# EAGLE design Micro4You (EAGLE 7.5.0)
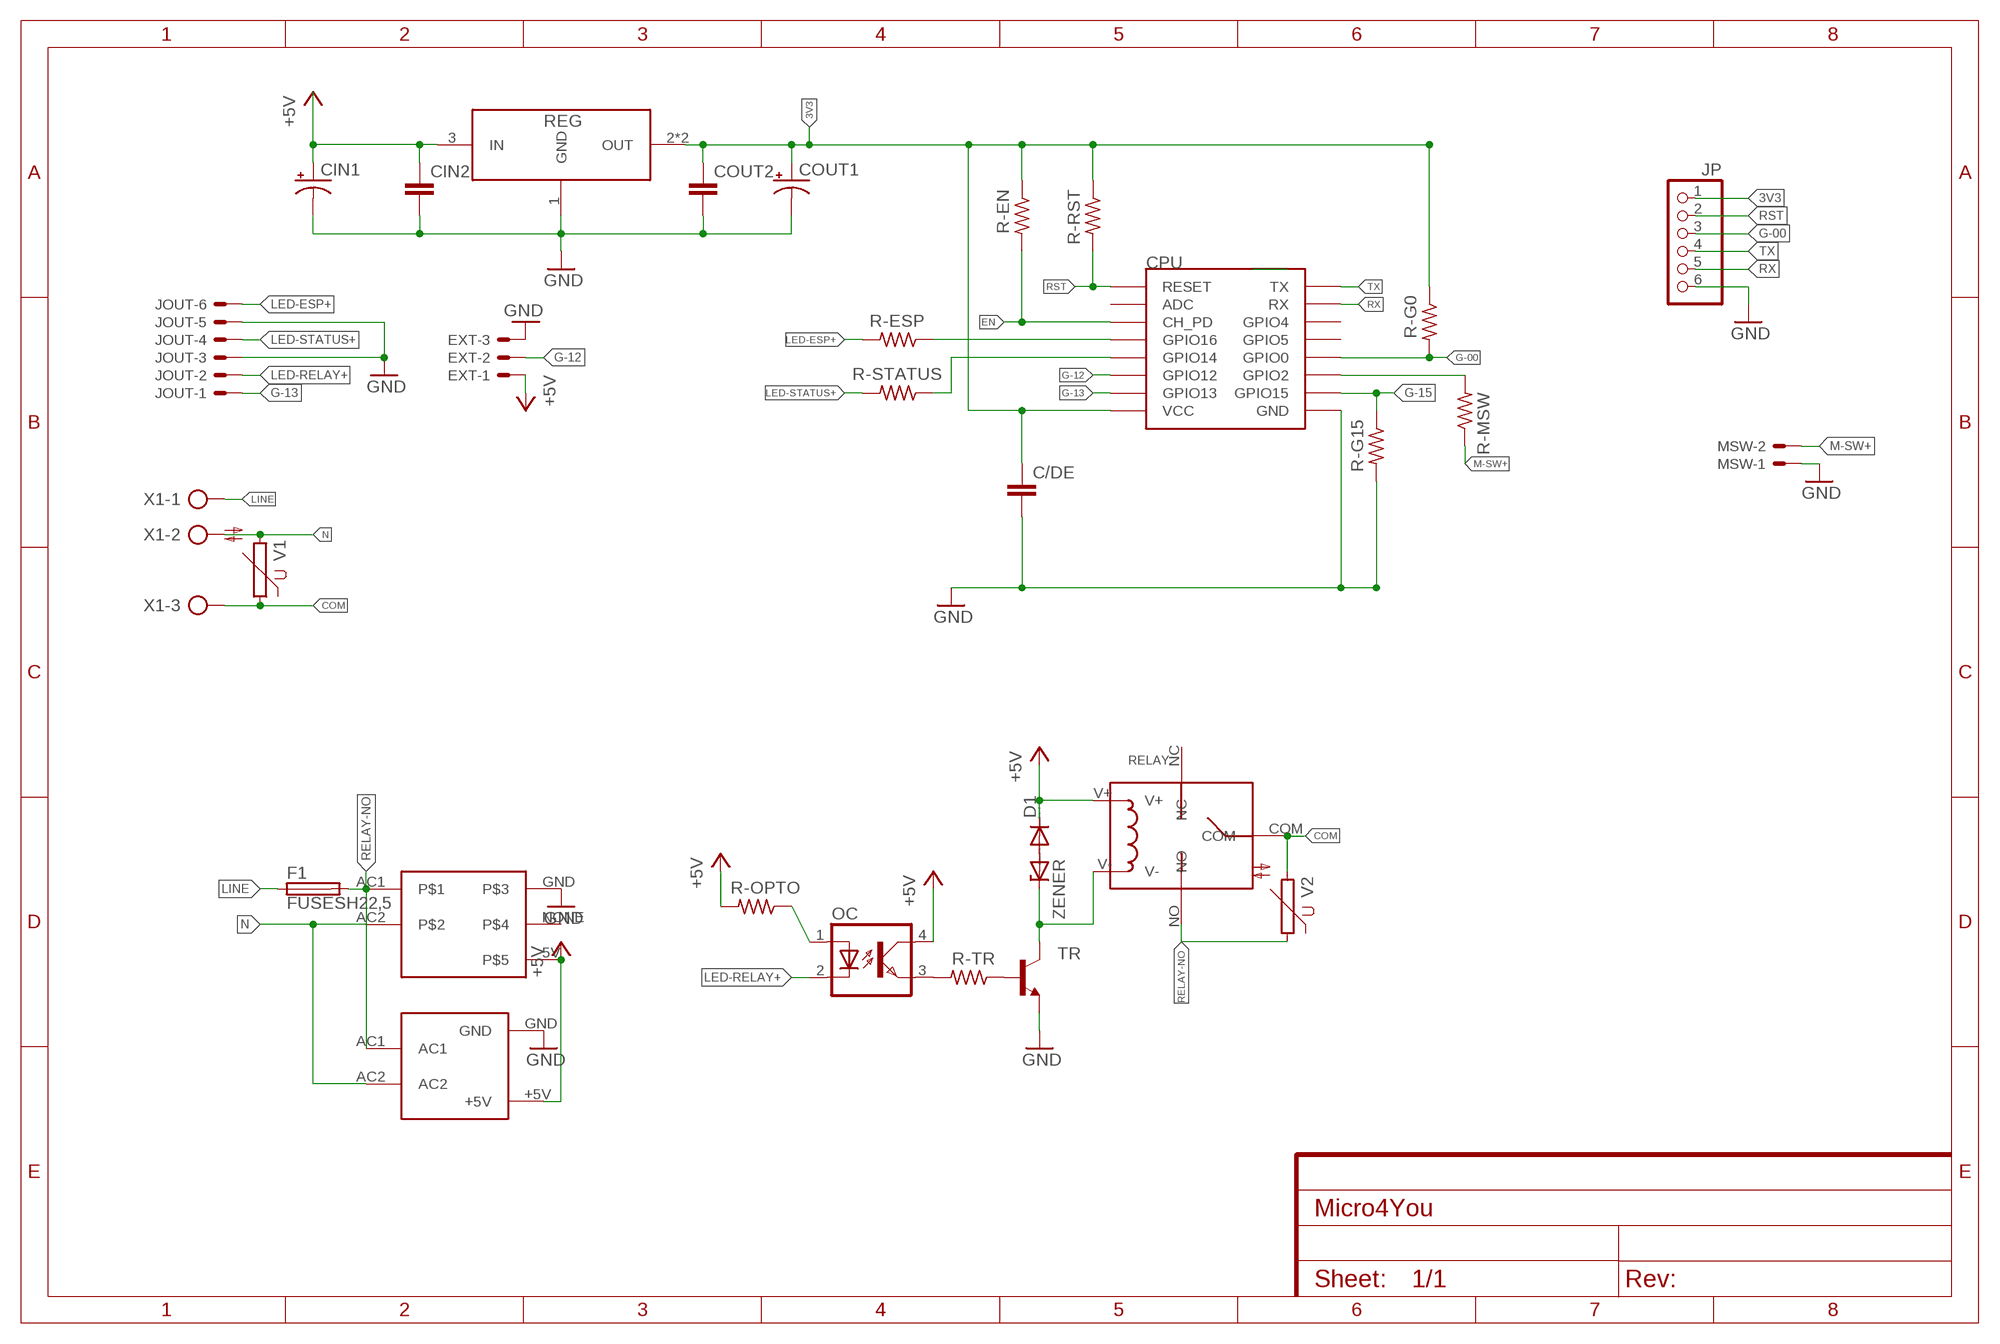
[diagram p0: schematic, sheet 1]

## Parts
C/DE  C-EUC0805  [C0805]
CIN1  CPOL-USE2.5-5  [E2,5-5]
CIN2  C-EUC0805  [C0805]
COUT1  CPOL-USE2.5-5  [E2,5-5]
COUT2  C-EUC0805  [C0805]
CPU  ESP12SMD  [ESP12-SMD]
D1  1N4148DO35-7  [DO35-7]
EXT  53048-03  [53048-03]
F1  FUSESH22,5  [SH22,5]
HLK  HLK-PM01  [HLK-PM01]
JOUT  53048-06  [53048-06]
JP  PINHD-1X6  [1X06]
MSW  53048-02  [53048-02]
OC  PC817  [DIL04]
R-EN  R-US_M0805  [M0805]
R-ESP  R-US_M0805  [M0805]
R-G0  R-US_M0805  [M0805]
R-G15  R-US_M0805  [M0805]
R-MSW  R-US_M0805  [M0805]
R-OPTO  R-US_M0805  [M0805]
R-RST  R-US_M0805  [M0805]
R-STATUS  R-US_M0805  [M0805]
R-TR  R-US_M0805  [M0805]
REG  AMS1117-3.3  [SOT-223]
RELAY  RELAY-SONGLE  [RELAY-SONGLE]
TR  BC817-16SMD  [SOT23-BEC]
U$4  POWERSUPPLY-5V-700MA  [POWERSUPPLY-5V-700MA]
V1  S14K11  [S14K11]
V2  S14K11  [S14K11]
X1  AK300/3  [AK300/3]
ZENER  1N4728  [DO41Z10]

## Nets
3V3: C/DE.1 COUT1.+ COUT2.1 CPU.VCC JP.1 R-EN.1 R-G0.1 R-RST.1 REG.2(OUT) REG.4(OUT)
+5V: CIN1.+ CIN2.1 D1.C EXT.1 HLK.+5V OC.4(COL) R-OPTO.2 REG.3(IN) RELAY.V+ U$4.5V
COM: RELAY.COM V1.1 V2.2 X1.3
EN: CPU.CH_PD R-EN.2
G-00: CPU.GPIO0 JP.3 R-G0.2
G-12: CPU.GPIO12 EXT.2
G-13: CPU.GPIO13 JOUT.1
G-15: CPU.GPIO15 R-G15.1
GND: C/DE.2 CIN1.- CIN2.2 COUT1.- COUT2.2 CPU.GND EXT.3 HLK.GND JOUT.3 JOUT.5 JP.6 MSW.1 R-G15.2 REG.1(GND) TR.E U$4.GND
LED-ESP+: JOUT.6 R-ESP.2
LED-RELAY+: JOUT.2 OC.2(C)
LED-STATUS+: JOUT.4 R-STATUS.2
LINE: F1.1 X1.1
M-SW+: MSW.2 R-MSW.1
N: HLK.AC2 U$4.AC2 V1.2 X1.2
N$1: OC.3(EMIT) R-TR.2
N$2: R-TR.1 TR.B
N$7: CPU.GPIO2 R-MSW.2
N$8: CPU.GPIO14 R-STATUS.1
N$13: OC.1(A) R-OPTO.1
N$16: D1.A ZENER.A
N$17: RELAY.V- TR.C ZENER.C
N$19: CPU.GPIO16 R-ESP.1
RELAY-NO: F1.2 HLK.AC1 RELAY.NO U$4.AC1 V2.1
RST: CPU.RESET JP.2 R-RST.2
RX: CPU.RXD0(RX) JP.5
TX: CPU.TXD0(TX) JP.4
Unconnected: CPU.ADC CPU.GPIO4 CPU.GPIO5 RELAY.NC U$4.NONE

## Library data of the parts
C/DE CIN2 COUT2 = rcl:C-EU: CAPACITOR, European symbol
CIN1 COUT1 = rcl:CPOL-US: POLARIZED CAPACITOR, American symbol
CPU = esp8266modules:ESP12: ESP8266 Wifi module 12
D1 = diode:1N4148: DIODE high speed (Philips)
EXT = con-molex:53?-03: CONNECTOR wire to board 1.25 mm (.049 inch) pitch header; MF: WALDOM/MOLEX; MPN: 53048-0310; OC_FARNELL: 9732918; OC_NEWARK: 38C9908
F1 = fuse:FUSE: Fuse; OC_FARNELL: unknown; OC_NEWARK: unknown
HLK = HLK-PM01:HLK-PM01
JOUT = con-molex:53?-06: CONNECTOR wire to board 1.25 mm (.049 inch) pitch header; MF: WALDOM/MOLEX; MPN: 53048-0610; OC_FARNELL: 1012260; OC_NEWARK: 38C9911
JP = pinhead:PINHD-1X6: PIN HEADER
MSW = con-molex:53?-02: CONNECTOR wire to board 1.25 mm (.049 inch) pitch header; MF: MOLEX; MPN: 53048-0210; OC_FARNELL: 1012259; OC_NEWARK: 57H4718
OC = optocoupler:PC817: SHARP OPTO COUPLER; MPN: PC817X4J000F; OC_FARNELL: 9707727; OC_NEWARK: 97K7059
R-EN R-ESP R-G0 R-G15 R-MSW R-OPTO R-RST R-STATUS R-TR = rcl:R-US_: RESISTOR, American symbol
REG = AMS1117-3.3:AMS1117-3.3: 1A LOW DROPOUT VOLTAGE REGULATOR
RELAY = Seeed-OPL-Relay:RELAY-SONGLE
TR = transistor-npn:BC817*: NPN Transistor
U$4 = PowerSupply-5V-700mA:POWERSUPPLY-5V-700MA
V1 V2 = varistor:S14K11: VARISTOR
X1 = con-ptr500:AK300/3: CONNECTOR; OC_FARNELL: unknown; OC_NEWARK: unknown
ZENER = diode:1N4728: Z DIODE 3.3 V, 1W, 5 percent

## Board
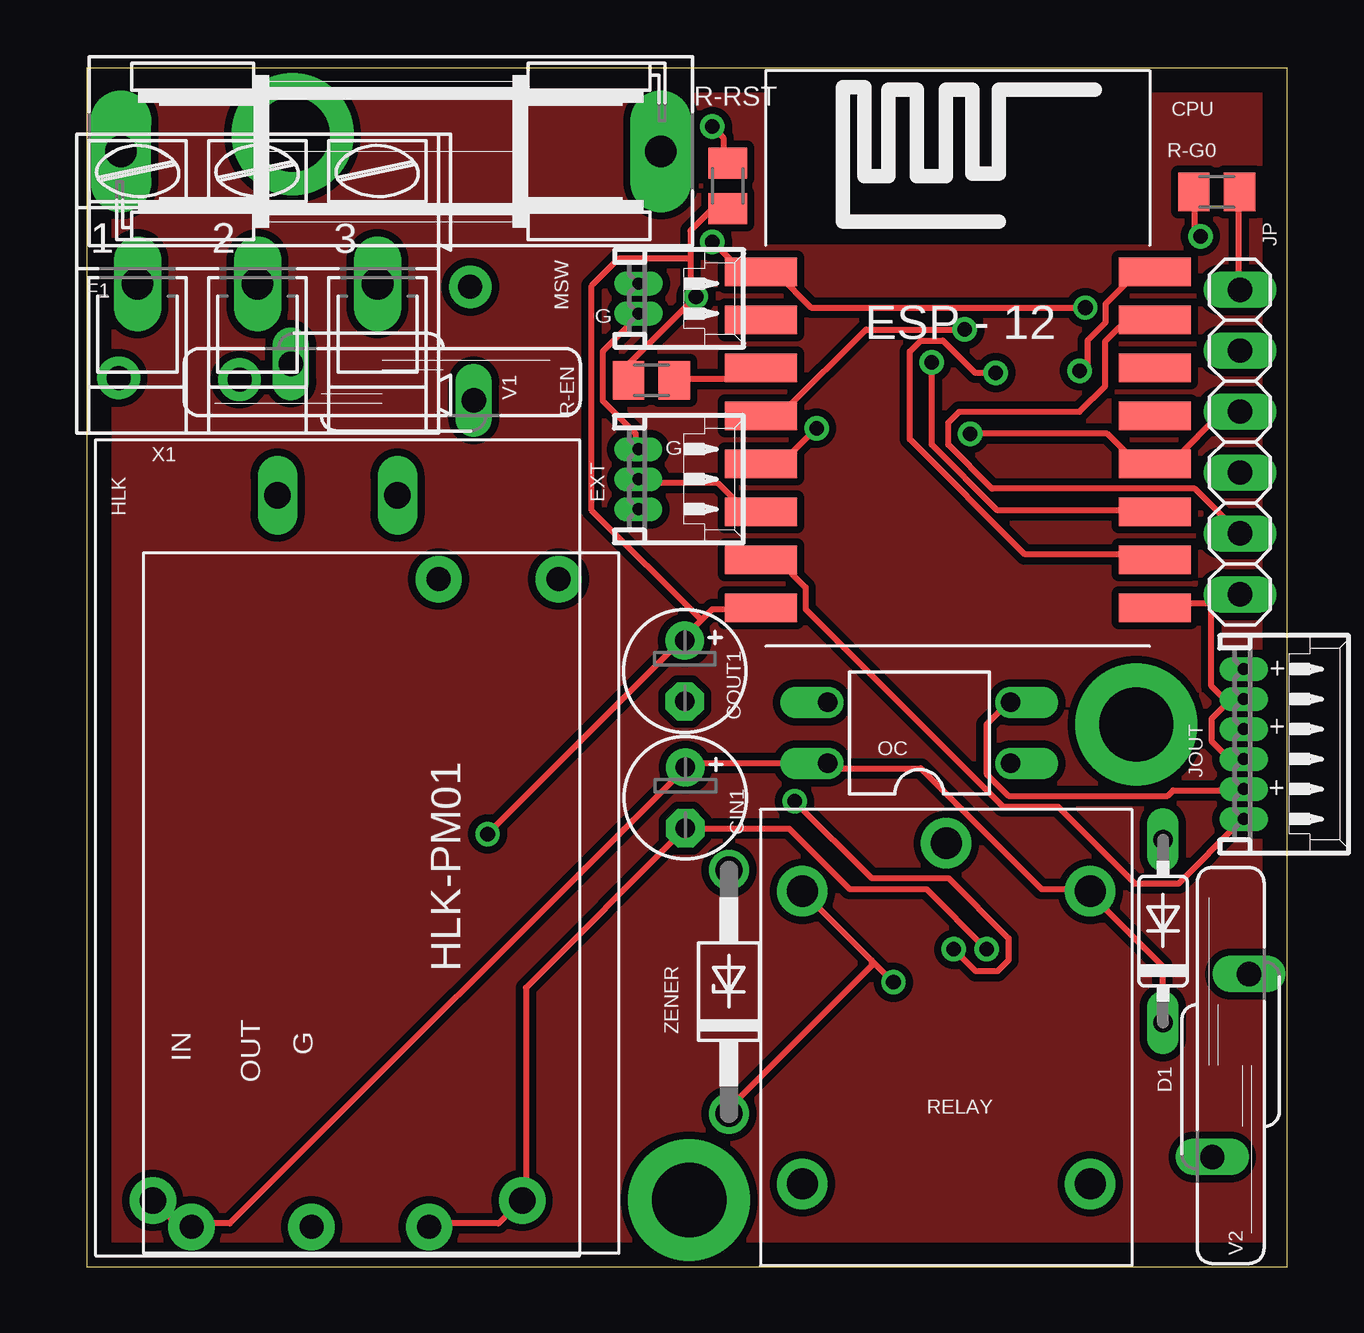
[diagram p1: board, top side]
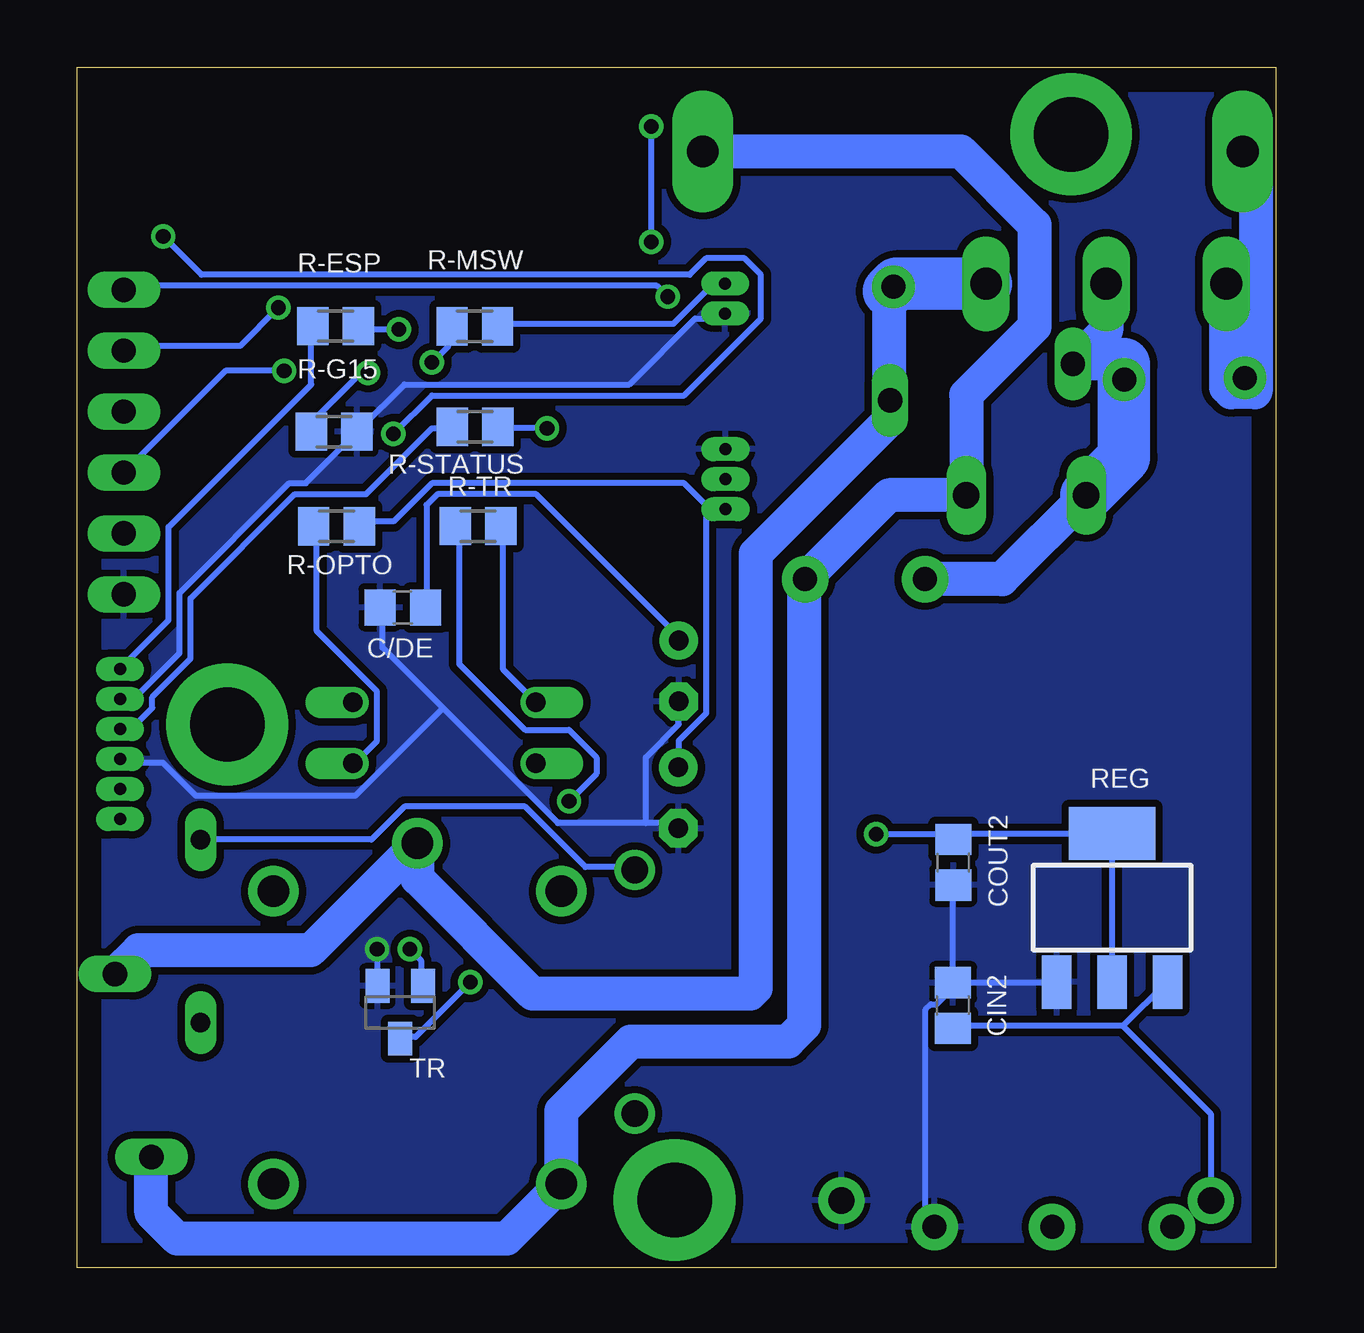
[diagram p2: board, bottom side, seen from below]

Size 50 x 50 mm. Coordinates in mm from the lower left corner, seen from the top.
Outline: 0,0 0,50 28.2,50 44.31,50 50,50 50,0 0,0
Copper layers (1*16): Top 0.035mm / dielectric 1.5mm / Bottom 0.035mm
Design rules "default": minimum track width 10mil, minimum drill 24mil, track to track 8mil, track to pad 8mil, pad to pad 8mil, via to via 8mil, smd to smd 8mil, copper to edge 40mil, drill to drill 8mil, minimum pad ring 10mil, minimum via ring 8mil, stop-mask expansion 4mil, vias tented up to drill 0mil, thermal gap 10mil

### Footprints (pad centres in the part's own frame; a part is rotated, then mirrored left to right if it is on the bottom)
C0805 = smd 1.3 x 1.5: 1 -0.95,0; 2 0.95,0
E2,5-5 = drill 0.813 pad 1.6: + -1.27,0 | drill 0.813 pad 1.6 octagon: - 1.27,0
ESP12-SMD = smd 3 x 1.2: ADC -8.3,3.8; CH_PD -8.3,1.8; GND 8.1,-8.2; GPIO0 8.1,-2.2; GPIO2 8.1,-4.2; GPIO4 8.1,1.8; GPIO5 8.1,-0.2; GPIO12 -8.3,-4.2; GPIO13 -8.3,-6.2; GPIO14 -8.3,-2.2; GPIO15 8.1,-6.2; GPIO16 -8.3,-0.2; RESET -8.3,5.8; RXD0 8.1,3.8; TXD0 8.1,5.8; VCC -8.3,-8.2
DO35-7 = drill 0.813 long: A 3.81,0; C -3.81,0
53048-03 = drill 0.5 pad 0.698 long: 1 1.25,-1.25; 2 0,-1.25; 3 -1.25,-1.25
SH22,5 = drill 1.321 pad 2.54 long: 1 -11.252,0; 2 11.252,0
HLK-PM01 = drill 1.1 pad 1.93: +5V 15.19,-7.76; GND 15.19,7.64 | drill 1.1 long: AC1 -14.21,2.44; AC2 -14.21,-2.56
53048-06 = drill 0.5 pad 0.698 long: 1 3.125,-1.25; 2 1.875,-1.25; 3 0.625,-1.25; 4 -0.625,-1.25; 5 -1.875,-1.25; 6 -3.125,-1.25
1X06 = drill 1.016 long: 1 -6.35,0; 2 -3.81,0; 3 -1.27,0; 4 1.27,0; 5 3.81,0; 6 6.35,0
53048-02 = drill 0.5 pad 0.698 long: 1 0.625,-1.25; 2 -0.625,-1.25
DIL04 = drill 0.813 offset: 1 -1.27,-3.81; 2 1.27,-3.81; 3 1.27,3.81; 4 -1.27,3.81
M0805 = smd 1.3 x 1.6: 1 -0.95,0; 2 0.95,0
SOT-223 = smd 1.219 x 2.235: 1 -2.381,-3.099; 2 -0.07,-3.099; 3 2.241,-3.099 | smd 3.6 x 2.2: 4 -0.07,3.099
RELAY-SONGLE = drill 1.3 pad 2.1: COM -8.1,0; NC 6.1,6; NO 6.1,-6; V+ -6.1,6; V- -6.1,-6
SOT23-BEC = smd 1 x 1.4: B -0.95,-1.1; C 0,1.1; E 0.95,-1.1
POWERSUPPLY-5V-700MA = drill 1 pad 1.93: 5V 13.5,-7.9; AC1 -13.5,7.4; AC2 -13.5,2.4; GND 13.5,2; NONE 13.5,-2.9
S14K11 = drill 1.016 long: 1 -0.762,-3.81; 2 0.762,3.81
AK300/3 = drill 1.321 long: 1 -5.004,0; 2 0,0; 3 5.004,0
DO41Z10 = drill 1.118: A 5.08,0; C -5.08,0

### Placement (x,y rotation side)
C/DE  36.42,27.51 180 bottom
CIN1  24.93,19.57 270 top
CIN2  13.49,10.92 90 bottom
COUT1  24.91,24.86 270 top
COUT2  13.48,16.88 270 bottom
CPU  36.39,35.69 0 top
D1  44.84,14.02 90 top
EXT  24.22,32.85 270 top
F1  12.66,46.52 0 top
HLK  10.49,17.98 270 top
JOUT  49.46,21.81 270 top
JP  48.05,34.4 270 top
MSW  24.23,40.39 270 top
OC  34.68,22.28 90 top
R-EN  23.52,36.97 0 top
R-ESP  39.22,39.23 180 bottom
R-G0  47.08,44.82 180 top
R-G15  39.28,34.84 0 bottom
R-MSW  33.42,39.22 180 bottom
R-OPTO  39.18,30.89 0 bottom
R-RST  26.7,45.08 90 top
R-STATUS  33.4,35.04 180 bottom
R-TR  33.28,30.9 0 bottom
REG  6.78,14.99 0 bottom
RELAY  35.81,9.58 270 top
TR  36.53,10.63 180 bottom
U$4  12.25,15.19 270 top
V1  12.3,36.9 90 top
V2  47.66,8.41 0 top
X1  7.1,41 0 top
ZENER  26.75,11.49 90 top

### Tracks (layer width: path | path; a pad name or v marks a point on that pad's centre or on a via)
3V3  (via drill 0.61)
  Top 0.254: R-G0.1 48.01,44.81 48.01,40.92 JP.1 | 25.15,42.06 25.15,43.2 26.06,44.12 26.52,44.12 R-RST.1 | 25.15,42.06 25.15,40.46 | 25.15,40.46 25.15,40.23 22.63,37.72 22.63,37.03 R-EN.1 | 25.15,40.46 v25.38,40.46 | 25.6,26.98 24.92,26.29 COUT1.+ 24.69,26.06 v16.69,18.06 | 25.6,26.98 26.06,27.43 27.89,27.43 CPU.VCC | 25.15,42.06 22.17,42.06 21.03,40.92 21.03,31.55 25.6,26.98
  Bottom 0.254: v25.38,40.46 25.83,40.92 48.01,40.92 JP.1 | 6.86,18.06 13.26,18.06 COUT2.1 13.49,18.06 v16.69,18.06 | 6.86,18.06 6.86,12.12 REG.2 | 6.86,18.06 REG.4 | C/DE.1 35.43,27.66 35.43,31.77 34.98,32.23 30.86,32.23 24.92,26.29 COUT1.+
+5V
  Top 0.254: HLK.+5V 2.74,2.74 3.66,1.83 4.34,1.83 U$4.5V 4.57,1.83 5.94,1.83 24.92,20.8 CIN1.+ 25.15,21.03 30.86,21.03 OC.4 31.09,20.8 34.75,20.8 39.78,15.77 41.6,15.77 RELAY.V+ 41.83,15.54 44.81,12.57 44.81,10.29 D1.C
  Bottom 0.254: 6.4,10.06 13.26,10.06 CIN2.1 | 6.4,10.06 4.57,11.89 REG.3 | 6.4,10.06 2.74,6.4 2.74,2.97 HLK.+5V | 23.77,31.77 24.69,32.69 35.2,32.69 36.8,31.09 38.18,31.09 R-OPTO.2 | 23.77,31.77 23.09,31.77 EXT.1 23.77,31.77 | 23.77,31.77 23.77,23.09 24.92,21.95 24.92,21.03 CIN1.+
COM
  Bottom 1.422: V2.2 47.43,13.22 40.27,13.22 RELAY.COM 35.81,16.21 31,11.4 21.94,11.4 21.71,11.63 21.71,29.74 16.11,35.34 V1.1 16.15,36.18 16.15,40.69
  Bottom 2.184: X1.3 15.84,41 16.15,40.69
EN
  Top 0.254: R-EN.2 24.69,37.03 27.43,37.03 27.89,37.49 CPU.CH_PD
G-00  (via drill 0.61)
  Top 0.254: v46.41,42.98 46.18,43.2 46.18,44.81 R-G0.2 | v36.8,34.75 42.52,34.75 43.66,33.6 44.35,33.6 CPU.GPIO0 44.58,33.6 45.26,33.6 47.32,35.66 48.01,35.66 JP.3
  Bottom 0.254: v46.41,42.98 44.81,41.38 24.46,41.38 23.77,42.06 22.17,42.06 21.49,41.38 21.49,39.55 24.69,36.35 35.2,36.35 v36.8,34.75
G-12
  Top 0.254: EXT.2 23.09,32.69 26.29,32.69 27.43,31.55 27.89,31.55 CPU.GPIO12
G-13
  Top 0.254: JOUT.1 48.01,18.52 45.49,16 43.66,16 40.46,19.2 38.18,19.2 29.95,27.43 29.95,28.35 28.8,29.49 28.12,29.49 CPU.GPIO13
G-15  (via drill 0.61)
  Top 0.254: CPU.GPIO15 44.35,29.72 39.09,29.72 34.29,34.52 34.29,38.18 34.75,38.63 35.66,38.63 37.01,37.29 v37.87,37.29
  Bottom 0.254: R-G15.1 40.01,34.98 40.01,35.43 38.15,37.29 v37.87,37.29
GND  (via drill 0.61)
  Top 0.254: 46.86,27.66 47.78,27.66 48.01,27.89 JP.6 46.86,27.66 | 46.86,27.66 44.58,27.66 CPU.GND | EXT.3 22.86,34.29 22.86,34.75 21.49,36.12 21.49,38.18 22.86,39.55 MSW.1 | 47.55,23.55 46.86,22.86 46.86,21.95 47.55,21.26 48.01,21.26 JOUT.3 | 47.55,23.55 48.01,23.55 JOUT.5 47.55,23.55 | 46.86,27.66 46.86,24.23 47.55,23.55 | U$4.GND 14.4,1.83 17.14,1.83 18.06,2.74 HLK.GND 18.29,2.97 18.29,11.66 24.92,18.29 CIN1.- 25.15,18.29 29.26,18.29 31.77,15.77 34.98,15.77 v37.49,13.26
  Bottom 0.254: JOUT.5 48.01,23.77 47.55,23.77 45.72,25.6 45.72,28.12 41.15,32.69 40.46,32.69 38.41,34.75 R-G15.2 38.18,34.98 36.35,36.8 26.98,36.8 24.23,39.55 23.09,39.55 MSW.1 | COUT2.2 13.49,15.77 13.49,11.89 CIN2.2 | REG.1 9.37,11.89 13.26,11.89 CIN2.2 | CIN2.2 13.49,11.66 14.17,10.97 14.4,10.97 14.63,10.74 14.63,2.06 14.4,1.83 U$4.GND | v37.49,13.26 37.49,11.89 TR.E | 34.75,23.32 29.95,18.52 26.29,18.52 | 34.75,23.32 37.26,25.83 37.26,27.43 C/DE.2 | 26.29,18.52 25.15,18.52 CIN1.- | 26.29,18.52 26.29,21.26 24.92,22.63 24.92,23.55 COUT1.- | 34.75,23.32 38.41,19.66 45.03,19.66 46.41,21.03 48.01,21.03 JOUT.3
  pour Bottom (isolate 0.305): 0,0 50,0 50,50 0,50
LED-ESP+
  Bottom 0.254: R-ESP.2 40.23,39.09 40.23,36.8 46.18,30.86 46.18,26.98 48.01,25.15 JOUT.6
LED-RELAY+
  Top 0.254: JOUT.2 48.01,19.89 45.26,19.89 45.03,19.66 38.41,19.66 37.49,20.57 37.49,22.63 38.41,23.55 OC.2
LED-STATUS+
  Bottom 0.254: R-STATUS.2 34.52,34.98 35.2,34.98 37.95,32.23 40.92,32.23 45.26,27.89 45.26,25.38 46.86,23.77 46.86,23.32 47.55,22.63 48.01,22.63 JOUT.4
LINE
  Bottom 1.422: F1.1 0.87,45.98 0.87,36.51 0.9,36.48 1.89,36.48 2.1,36.69 X1.1
M-SW+
  Bottom 0.254: R-MSW.1 32.46,39.32 25.15,39.32 23.55,40.92 23.09,40.92 MSW.2
N
  Bottom 1.422: HLK.AC2 11.44,28.69 U$4.AC2 | 6.36,37.64 6.38,37.66 V1.2 7.1,39.05 X1.2
  Bottom 2.184: HLK.AC2 6.36,33.76 6.36,37.64
N$1
  Bottom 0.254: R-TR.2 32.23,30.86 32.23,24.92 31.09,23.77 OC.3
N$2  (via drill 0.61)
  Top 0.254: v36.12,13.26 37.03,12.34 37.95,12.34 38.41,12.8 38.41,13.72 35.89,16.23 32.69,16.23 v29.49,19.43
  Bottom 0.254: v36.12,13.26 35.66,12.8 35.66,11.89 TR.B | v29.49,19.43 28.35,20.57 28.35,21.26 29.49,22.4 31.32,22.4 34.06,25.15 34.06,30.86 R-TR.1
N$3  (via drill 3.1 pad 5.08)
  other vias: 25.09,2.81
N$4
  pour Top (isolate 0.305): 0,0 50,0 50,50 44.4,50 44.4,42.5 28.19,42.5 28.19,50 0,50
N$7  (via drill 0.61)
  Top 0.254: v35.2,37.72 35.2,34.29 37.95,31.55 44.35,31.55 CPU.GPIO2
  Bottom 0.254: v35.2,37.72 34.52,38.41 34.52,39.09 R-MSW.2
N$8  (via drill 0.61)
  Top 0.254: v30.4,34.98 29.03,33.6 28.12,33.6 CPU.GPIO14
  Bottom 0.254: v30.4,34.98 32.23,34.98 R-STATUS.1
N$9  (via drill 3.1 pad 5.08)
  other vias: 43.73,22.63
N$13
  Bottom 0.254: R-OPTO.1 40.01,30.86 40.01,26.52 37.49,24 37.49,21.95 38.41,21.03 OC.1
N$16
  Bottom 0.254: D1.A 44.81,17.83 37.72,17.83 36.35,19.2 31.32,19.2 28.8,16.69 26.75,16.69 ZENER.A
N$17  (via drill 0.61)
  Top 0.254: 32.69,12.8 29.95,15.54 RELAY.V- | 32.69,12.8 v33.6,11.89 | 32.69,12.8 32.69,12.57 26.75,6.63 ZENER.C
  Bottom 0.254: v33.6,11.89 35.89,9.6 36.35,9.6 TR.C
N$18  (via drill 3.1 pad 5.08)
  other vias: 8.56,47.23
N$19  (via drill 0.61)
  Top 0.254: v36.58,39.09 32.46,39.09 29.03,35.66 28.12,35.66 CPU.GPIO16
  Bottom 0.254: v36.58,39.09 38.18,39.09 R-ESP.1
N$20  (via drill 1 pad 1.78)
  other vias: 1.32,37.07
N$21  (via drill 1 pad 1.78)
  other vias: 6.35,37
N$22  (via drill 1 pad 1.78)
  other vias: 15.97,40.87
RELAY-NO
  Bottom 1.422: V2.1 46.9,2.28 45.82,1.2 32.09,1.2 RELAY.NO 29.81,6.52 26.91,9.42 20.36,9.42 19.68,10.1 19.68,28.66 U$4.AC1 16.15,32.19 HLK.AC1 12.94,36.38 10.09,39.22 10.09,43.45 13.16,46.52 F1.2
RST  (via drill 0.61)
  Top 0.254: v26.06,47.55 26.52,47.09 26.52,46.18 R-RST.2 | v26.06,42.75 27.43,41.38 27.89,41.38 CPU.RESET 28.12,41.38 28.8,41.38 30.18,40.01 v41.6,40.01
  Bottom 0.254: v26.06,42.75 v26.06,47.55 | v41.6,40.01 43.2,38.41 48.01,38.41 JP.2
RX
  Top 0.254: CPU.RXD0 44.35,39.32 43.66,39.32 43.53,39.19 43.02,39.19 42.43,38.6 42.43,36.73 41.36,35.66 36.35,35.66 35.89,35.2 35.89,34.29 37.72,32.46 46.18,32.46 48.01,30.63 JP.5
TX  (via drill 0.61)
  Top 0.254: CPU.TXD0 44.35,41.38 43.66,41.38 42.45,40.16 42.45,39.39 41.7,38.64 41.7,37.71 v41.37,37.37
  Bottom 0.254: v41.37,37.37 43.81,37.37 JP.4

### Text on the board
tNames: G | G | + | + | + | IN | G | OUT